# EAGLE design RTC-mezzanine (EAGLE 9.6.2)
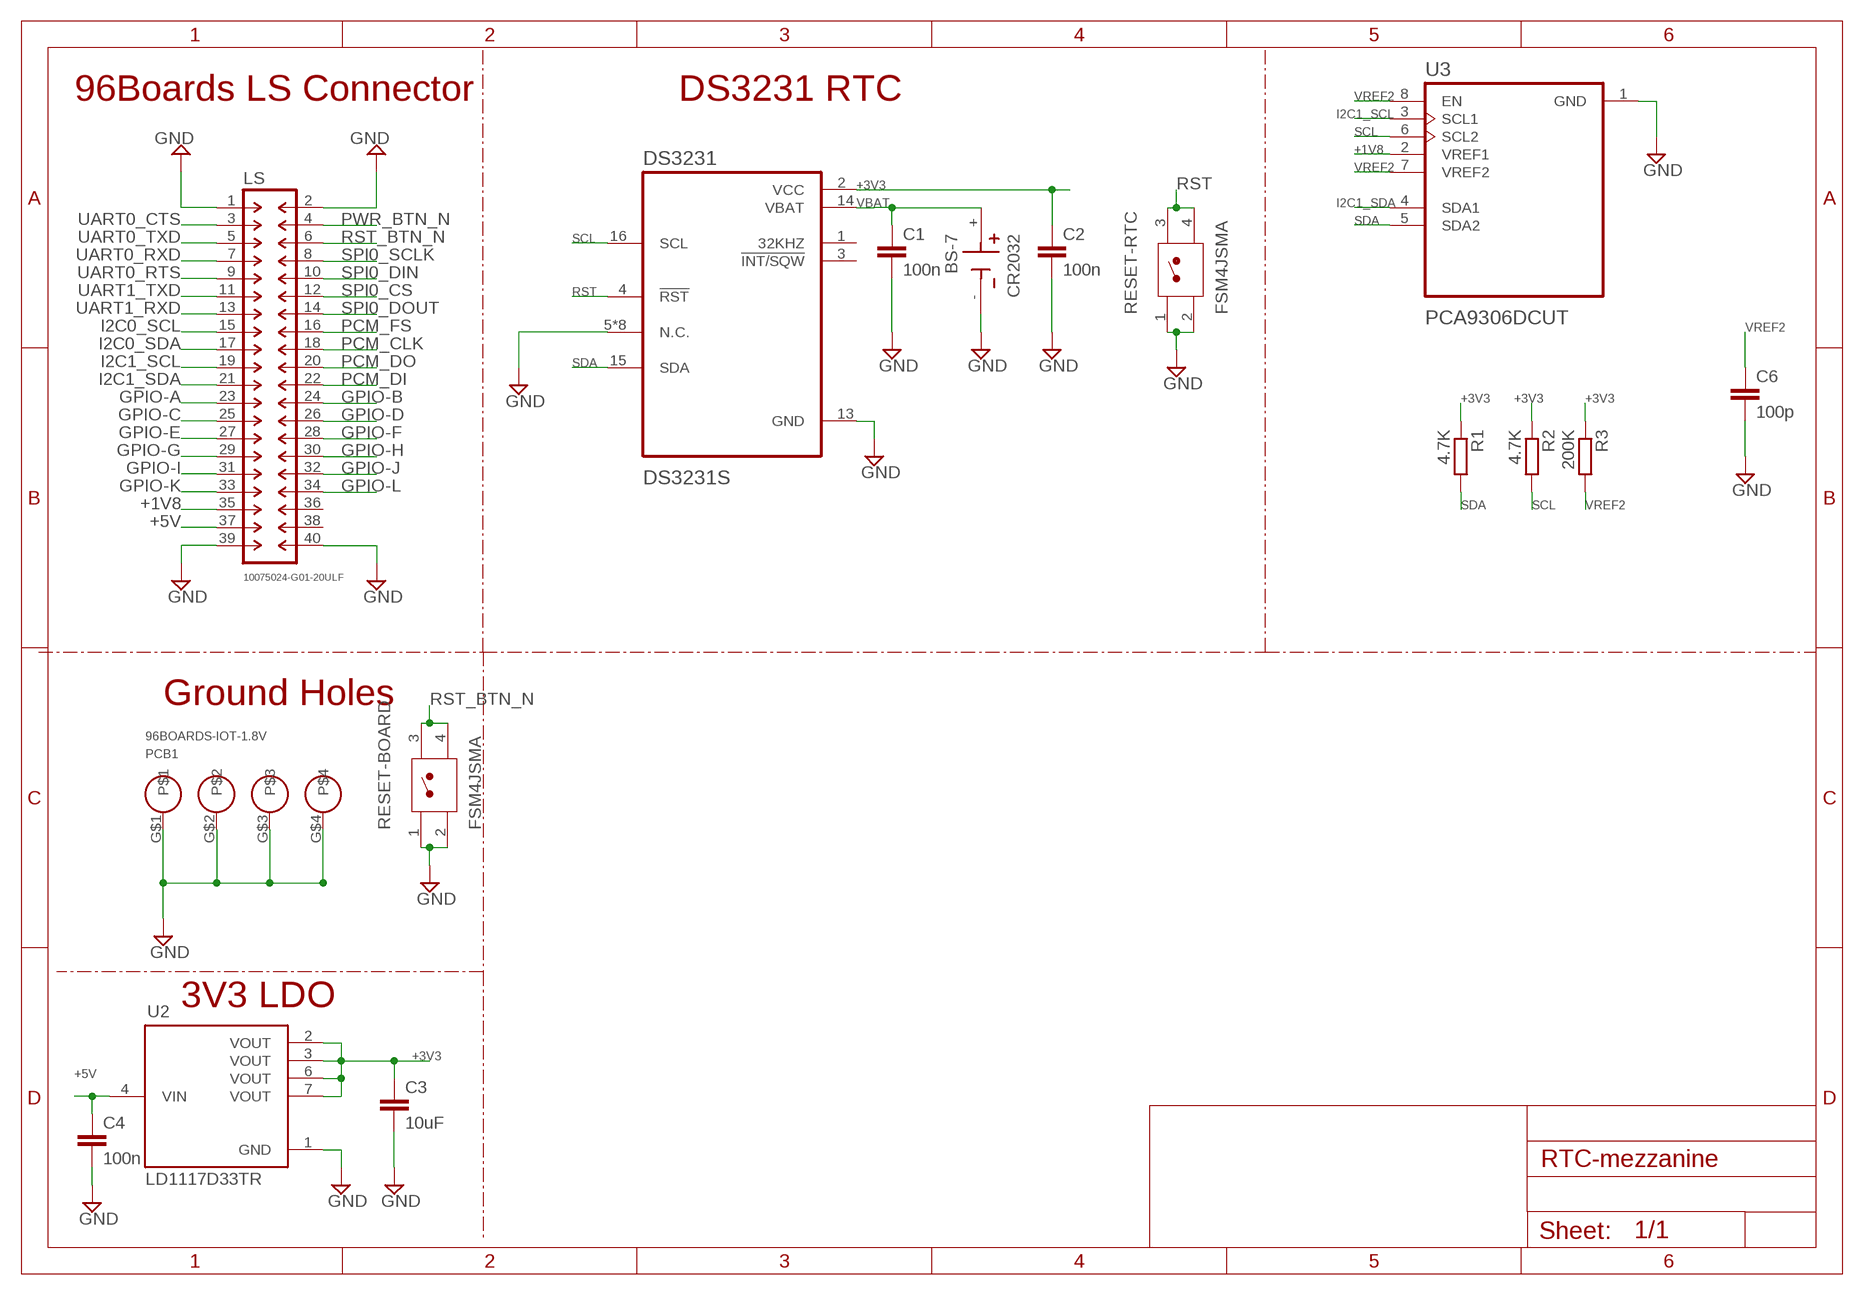
[diagram p0: schematic, sheet 1]

## Parts
C1  100n  C-EUC0603  [C0603]
C2  100n  C-EUC0603  [C0603]
C3  10uF  C-EUC0805  [C0805]
C4  100n  C-EUC0603  [C0603]
C6  100p  C-EUC0603  [C0603]
CR2032  BS-7  [BAT_BS-7]
DS3231  DS3231S  [SOIC127P1032X265-16N]
LS  10075024-G01-20ULF  [10075024-G01-20ULF]
PCB1  96BOARDS-IOT-1.8V  [96BOARDS-IOT-1.8V]
R1  4.7K  R-EU_R0603  [R0603]
R2  4.7K  R-EU_R0603  [R0603]
R3  200K  R-EU_R0603  [R0603]
RESET-BOARD  FSM4JSMA  [TE_FSM4JSMA]
RESET-RTC  FSM4JSMA  [TE_FSM4JSMA]
U2  LD1117D33TR  [SOIC127P600X175-8N]
U3  PCA9306DCUT  [SOP50P310X90-8N]

## Nets
+1V8: LS.35 U3.2(VREF1)
+3V3: C2.1 C3.1 DS3231.2(VCC) R1.1 R2.1 R3.1 U2.2(VOUT) U2.3(VOUT) U2.6(VOUT) U2.7(VOUT)
+5V: C4.1 LS.37 U2.4(VIN)
GND: C1.2 C2.2 C3.2 C4.2 C6.2 CR2032.- DS3231.5(N.C.) DS3231.6(N.C.) DS3231.7(N.C.) DS3231.8(N.C.) DS3231.9(N.C.) DS3231.10(N.C.) DS3231.11(N.C.) DS3231.12(N.C.) DS3231.13(GND) LS.2 LS.39 LS.40 PCB1.G$1 PCB1.G$2 PCB1.G$3 PCB1.G$4 RESET-BOARD.1 RESET-BOARD.2 RESET-RTC.1 RESET-RTC.2 U2.1(GND) U3.1(GND)
GPIO-A: LS.23
GPIO-B: LS.24
GPIO-C: LS.25
GPIO-D: LS.26
GPIO-E: LS.27
GPIO-F: LS.28
GPIO-G: LS.29
GPIO-H: LS.30
GPIO-I: LS.31
GPIO-J: LS.32
GPIO-K: LS.33
GPIO-L: LS.34
I2C0_SCL: LS.15
I2C0_SDA: LS.17
I2C1_SCL: LS.19 U3.3(SCL1)
I2C1_SDA: LS.21 U3.4(SDA1)
N$1: LS.1 ; supply symbol labelled GND
PCM_CLK: LS.18
PCM_DI: LS.22
PCM_DO: LS.20
PCM_FS: LS.16
PWR_BTN_N: LS.4
RST: DS3231.4(!RST) RESET-RTC.3 RESET-RTC.4
RST_BTN_N: LS.6 RESET-BOARD.3 RESET-BOARD.4
SCL: DS3231.16(SCL) R2.2 U3.6(SCL2)
SDA: DS3231.15(SDA) R1.2 U3.5(SDA2)
SPI0_CS: LS.12
SPI0_DIN: LS.10
SPI0_DOUT: LS.14
SPI0_SCLK: LS.8
UART0_CTS: LS.3
UART0_RTS: LS.9
UART0_RXD: LS.7
UART0_TXD: LS.5
UART1_RXD: LS.13
UART1_TXD: LS.11
VBAT: C1.1 CR2032.+ DS3231.14(VBAT)
VREF2: C6.1 R3.2 U3.7(VREF2) U3.8(EN)
Unconnected: DS3231.1(32KHZ) DS3231.3(!INT/SQW) LS.36 LS.38

## Notes on the sheet
- 96Boards LS Connector | DS3231 RTC
- Ground Holes
- 3V3 LDO

## Library data of the parts
C1-C4 C6 = rcl:C-EU: CAPACITOR, European symbol; SPICEPREFIX: C
CR2032 = BS-7:BS-7: BATTERY HOLDER COIN 20MM PC PIN Check prices <https://pricing.snapeda.com/parts/BS-7/MPD%20%28Memory/view-part?ref=eda>; AVAILABILITY: Warning; DESCRIPTION: BATTERY HOLDER COIN 20MM PC PIN; MF: MPD (Memory; MP: BS-7; PACKAGE: None; PRICE: None
DS3231 = DS3231S:DS3231S: Check prices <https://pricing.snapeda.com/parts/DS3231S/Maxim%20Integrated/view-part?ref=eda>; AVAILABILITY: Warning; DESCRIPTION: Real Time Clock (RTC) IC Clock/Calendar I²C, 2-Wire Serial 16-SOIC (0.295, 7.50mm Width); MF: Maxim Integrated; MP: DS3231S; PACKAGE: SOIC-16 Maxim Integrated; PRICE: None; PURCHASE-URL: https://pricing.snapeda.com/search/part/DS3231S/?ref=eda
LS = 96Boards-IoT-Mezzanine:10075024-G01-20ULF: MALE HEADER
PCB1 = 96Boards-IoT-Mezzanine:96BOARDS-IOT-1.8V
R1-R3 = rcl:R-EU_: RESISTOR, European symbol; SPICEPREFIX: R
RESET-BOARD RESET-RTC = FSM4JSMA:FSM4JSMA: Switch Tactile OFF (ON) SPST Round Button Gull Wing 0.05A 24VDC 2.6N SMD T/R Check prices <https://pricing.snapeda.com/parts/FSM4JSMA/TE%20Connectivity/view-part?ref=eda>; AVAILABILITY: Good; COMMENT: 4-1437565-1; CONFIGURATION_POLE-THROW: Single Pole - Single Throw; CONTACT_CURRENT_RATING: 50 mA; DESCRIPTION: Tactile Switch SPST-NO Top Actuated Surface Mount; EU_ROHS_COMPLIANCE: Compliant; MF: TE Connectivity; MP: FSM4JSMA; PACKAGE: None; PRICE: None; PURCHASE-URL: https://pricing.snapeda.com/search/part/FSM4JSMA/?ref=eda
U2 = LD1117D33TR:LD1117D33TR: LD1117 Series 1300 mA Low Drop Fixed Positive Voltage Regulator - SOIC-8 Check prices <https://pricing.snapeda.com/parts/LD1117D33TR/STMicroelectronics/view-part?ref=eda>; AVAILABILITY: Warning; DESCRIPTION: Linear Voltage Regulator IC 1 Output 800mA 8-SO; MF: STMicroelectronics; MP: LD1117D33TR; PACKAGE: SO-8 STMicroelectronics; PRICE: None; PURCHASE-URL: https://pricing.snapeda.com/search/part/LD1117D33TR/?ref=eda
U3 = PCA9306DCUT:PCA9306DCUT: Check prices <https://pricing.snapeda.com/parts/PCA9306DCUT/Texas%20Instruments/view-part?ref=eda>; AVAILABILITY: Good; DESCRIPTION: 2-bit bidirectional I2C bus and SMBus voltage-level shifter 8-VSSOP -40 to 85; MF: Texas Instruments; MP: PCA9306DCUT; PACKAGE: VSSOP-8 Texas Instruments; PRICE: None; PURCHASE-URL: https://pricing.snapeda.com/search/part/PCA9306DCUT/?ref=eda

## Board
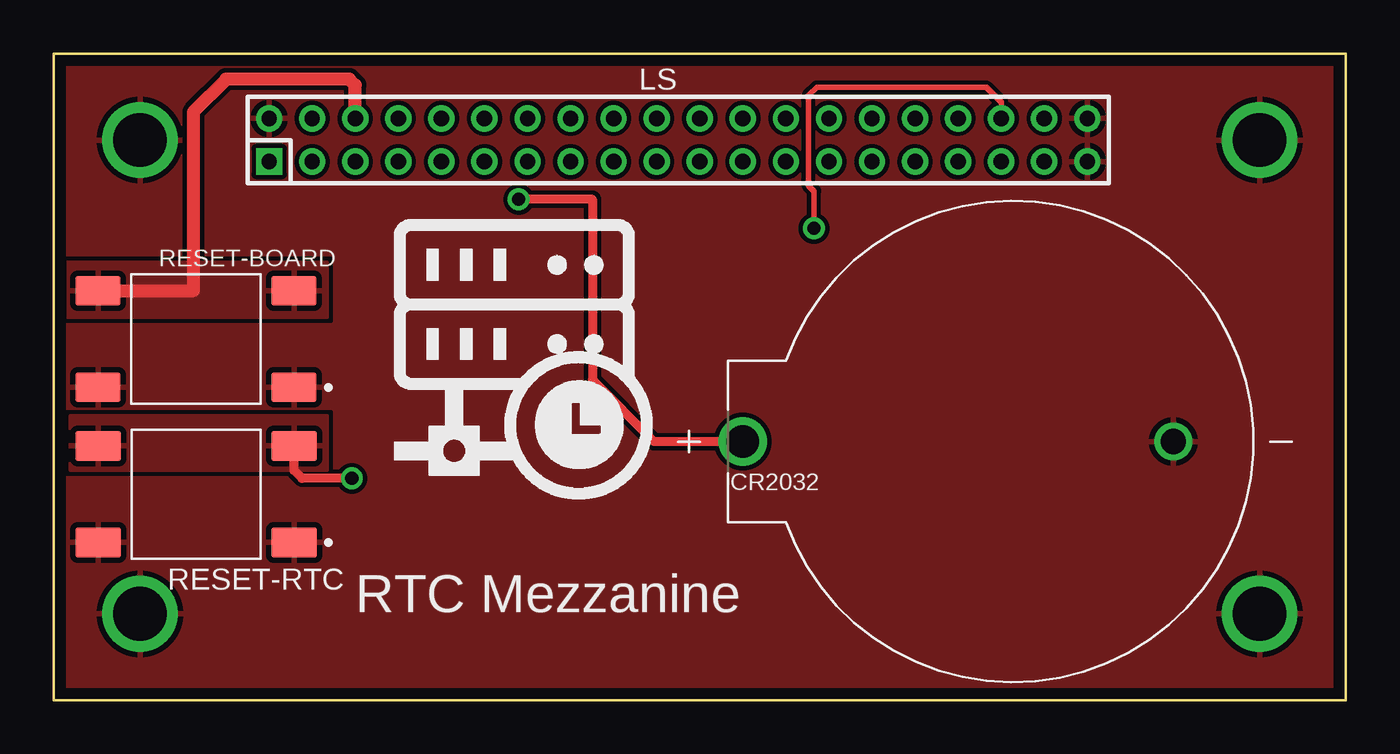
[diagram p1: board, top side]
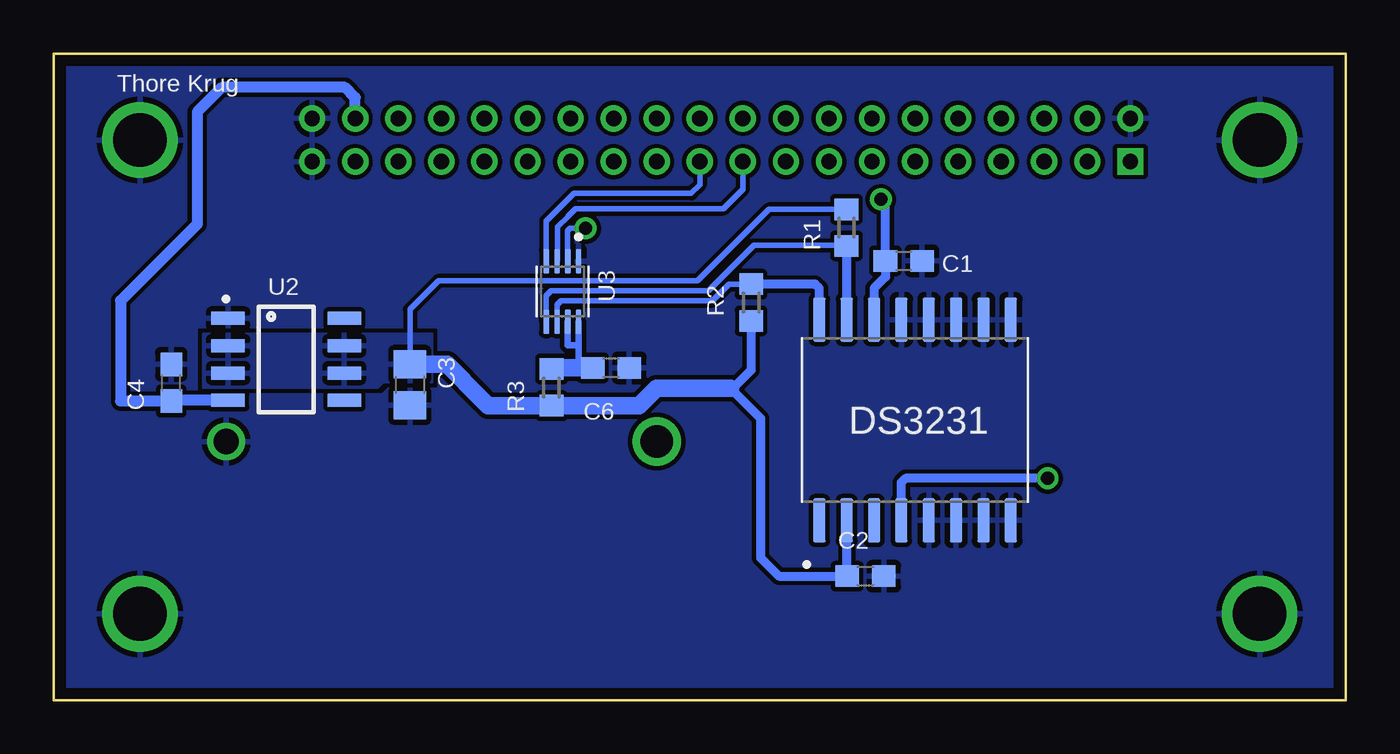
[diagram p2: board, bottom side, seen from below]

Size 60 x 30 mm. Coordinates in mm from the lower left corner, seen from the top.
Copper layers (1*16): Top 0.035mm / dielectric 1.5mm / Bottom 0.035mm
Design rules "default *": minimum track width 10mil, minimum drill 24mil, track to track 8mil, track to pad 8mil, pad to pad 8mil, via to via 8mil, smd to smd 8mil, copper to edge 20mil, drill to drill 8mil, minimum pad ring 10mil, minimum via ring 8mil, stop-mask expansion 4mil, vias tented up to drill 0mil, thermal gap 10mil

### Footprints (pad centres in the part's own frame; a part is rotated, then mirrored left to right if it is on the bottom)
C0603 = smd 1.1 x 1: 1 -0.85,0; 2 0.85,0
C0805 = smd 1.3 x 1.5: 1 -0.95,0; 2 0.95,0
BAT_BS-7 = drill 1.5: + 10,0 | drill 1.17: - -10,0
SOIC127P1032X265-16N = smd 2.05 x 0.59: 1 -4.655,4.445; 2 -4.655,3.175; 3 -4.655,1.905; 4 -4.655,0.635; 5 -4.655,-0.635; 6 -4.655,-1.905; 7 -4.655,-3.175; 8 -4.655,-4.445; 9 4.655,-4.445; 10 4.655,-3.175; 11 4.655,-1.905; 12 4.655,-0.635; 13 4.655,0.635; 14 4.655,1.905; 15 4.655,3.175; 16 4.655,4.445
10075024-G01-20ULF = drill 0.711 square: 1 -19,-1 | drill 0.711: 2 -19,1; 3 -17,-1; 4 -17,1; 5 -15,-1; 6 -15,1; 7 -13,-1; 8 -13,1; 9 -11,-1; 10 -11,1; 11 -9,-1; 12 -9,1; 13 -7,-1; 14 -7,1; 15 -5,-1; 16 -5,1; 17 -3,-1; 18 -3,1; 19 -1,-1; 20 -1,1; 21 1,-1; 22 1,1; 23 3,-1; 24 3,1; 25 5,-1; 26 5,1; 27 7,-1; 28 7,1; 29 9,-1; 30 9,1; 31 11,-1; 32 11,1; 33 13,1; 34 13,-1; 35 15,1; 36 15,-1; 37 17,1; 38 17,-1; 39 19,1; 40 19,-1
96BOARDS-IOT-1.8V = drill 2.5: G$1 4,4; G$2 56,4; G$3 56,26; G$4 4,26
R0603 = smd 1 x 1.1: 1 -0.85,0; 2 0.85,0
TE_FSM4JSMA = smd 2.1 x 1.38: 1 -4.55,2.24; 2 4.55,2.24; 3 -4.55,-2.24; 4 4.55,-2.24
SOIC127P600X175-8N = smd 1.55 x 0.6: 1 -2.7,1.905; 2 -2.7,0.635; 3 -2.7,-0.635; 4 -2.7,-1.905; 5 2.7,-1.905; 6 2.7,-0.635; 7 2.7,0.635; 8 2.7,1.905
SOP50P310X90-8N = smd 1.12 x 0.27: 1 -1.405,0.75; 2 -1.405,0.25; 3 -1.405,-0.25; 4 -1.405,-0.75; 5 1.405,-0.75; 6 1.405,-0.25; 7 1.405,0.25; 8 1.405,0.75

### Placement (x,y rotation side)
C1  20.52,20.39 0 bottom
C2  22.3,5.75 0 bottom
C3  43.46,14.63 270 bottom
C4  54.54,14.73 90 bottom
C6  34.12,15.42 0 bottom
CR2032  42,12 180 top
DS3231  20,13 90 bottom
LS  29,26 0 top
PCB1  0,0 0 top
R1  23.18,21.93 270 bottom
R2  27.62,18.45 90 bottom
R3  36.89,14.52 90 bottom
RESET-BOARD  6.6,16.76 180 top
RESET-RTC  6.61,9.56 180 top
U2  49.21,15.81 0 bottom
U3  36.38,18.97 270 bottom

### Tracks (layer width: path | path; a pad name or v marks a point on that pad's centre or on a via)
+1V8  (via drill 0.61)
  Top 0.254: v35.31,21.89 35.31,23.62 35.05,23.88 35.05,28.07 35.43,28.45 43.31,28.45 44,27.75 LS.35
  Bottom 0.254: v35.31,21.89 36.02,21.89 36.13,21.78 U3.2
+3V3
  Bottom 0.254: C3.1 43.46,18.13 42.14,19.46 30.1,19.46 26.77,22.78 R1.1
  Bottom 0.406: 28.45,14.48 28.57,14.48 27.18,13.08 27.18,6.6 26.33,5.75 C2.1 23.15,8.32 DS3231.2 | R2.1 27.62,15.31 28.45,14.48 | 28.4,14.48 28.45,14.48
  Bottom 0.813: C3.1 41.74,15.58 40.13,13.97 39.83,13.67 R3.1 32.81,13.67 32,14.48 28.57,14.48
  pour Bottom: 42.42,17.02 53.09,17.02 53.09,14.48 44.96,14.48 44.7,14.73 42.42,14.73
+5V
  Bottom 0.508: U2.4 54.51,13.91 C4.1 56.9,13.88 56.9,18.54 53.34,22.1 53.34,27.3 52.2,28.45 46.48,28.45 46,27.97 LS.37
GND
  pour Top (rank 2): 0,30.1 60.2,30.1 60.2,-0.13 -0.13,-0.13 -0.13,30.1
  pour Bottom (rank 2): -0.13,30.1 60.2,30.1 60.2,-0.13 -0.13,-0.13
I2C1_SCL
  Bottom 0.254: U3.3 36.59,20.41 36.59,21.96 36.12,22.44 36.12,22.45 35.76,22.81 28.91,22.81 28,23.71 LS.19
I2C1_SDA
  Bottom 0.254: LS.21 30,23.93 30.4,23.52 35.84,23.52 37.13,22.23 U3.4
RST  (via drill 0.61)
  Top 0.406: v13.84,10.29 11.53,10.29 11.16,10.66 RESET-RTC.3
  Bottom 0.406: DS3231.4 20.64,10.1 20.45,10.29 v13.84,10.29
  pour Top: 0.76,13.21 12.7,13.21 12.7,10.67 0.76,10.67
RST_BTN_N
  Top 0.61: LS.6 14,28.55 13.72,28.83 8,28.83 6.48,27.3 6.48,19 RESET-BOARD.4
  pour Top: 0.51,20.32 12.7,20.32 12.7,17.78 0.51,17.78
SCL
  Bottom 0.254: U3.6 36.63,18.36 36.45,18.54 29.4,18.54 28.64,19.3 R2.2
  Bottom 0.406: DS3231.16 24.45,19.11 24.64,19.3 R2.2
SDA
  Bottom 0.254: R1.2 23.21,21.11 27.48,21.11 29.59,19 36.91,19 37.13,18.77 U3.5
  Bottom 0.406: DS3231.15 R1.2
VBAT  (via drill 0.61)
  Top 0.406: CR2032.+ 27.88,12 25.02,14.86 25.02,23.24 v21.59,23.24
  Bottom 0.406: DS3231.14 21.91,19.12 21.38,19.65 C1.1 21.38,23.03 v21.59,23.24
VREF2
  Bottom 0.305: 35.63,16.58 35.63,16.48 36.13,16.48 U3.7 | U3.8 35.63,16.58 | 35.63,16.58 35.63,15.42 C6.1
  Bottom 0.813: C6.1 36.83,15.42 R3.2

### Text on the board
bPlace: Thore Krug
tNames: RTC Mezzanine